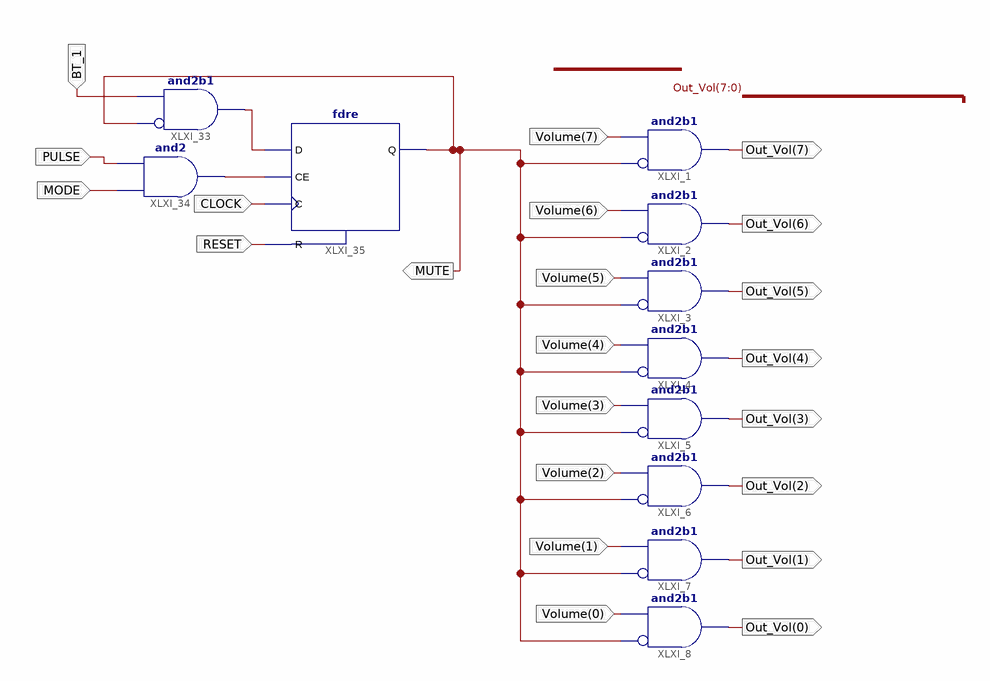
[diagram p0: schematic sheet 1]
// Xilinx ISE schematic mute_control.sch (spartan3e) as structural Verilog: 11 symbols, 22 ports
module mute_control (
  input  [7:0] Volume,
  input  CLOCK,
  input  BT_1,
  input  PULSE,
  input  MODE,
  input  RESET,
  output [7:0] Out_Vol,
  output MUTE
);

  wire XLXN_48, XLXN_52;

  and XLXI_1 (Out_Vol[7], ~MUTE, Volume[7]);  // and2b1
  and XLXI_2 (Out_Vol[6], ~MUTE, Volume[6]);  // and2b1
  and XLXI_3 (Out_Vol[5], ~MUTE, Volume[5]);  // and2b1
  and XLXI_4 (Out_Vol[4], ~MUTE, Volume[4]);  // and2b1
  and XLXI_5 (Out_Vol[3], ~MUTE, Volume[3]);  // and2b1
  and XLXI_6 (Out_Vol[2], ~MUTE, Volume[2]);  // and2b1
  and XLXI_7 (Out_Vol[1], ~MUTE, Volume[1]);  // and2b1
  and XLXI_8 (Out_Vol[0], ~MUTE, Volume[0]);  // and2b1
  and XLXI_33 (XLXN_48, ~MUTE, BT_1);  // and2b1
  and XLXI_34 (XLXN_52, MODE, PULSE);
  fdre XLXI_35 (.C(CLOCK), .CE(XLXN_52), .D(XLXN_48), .R(RESET), .Q(MUTE));
endmodule
